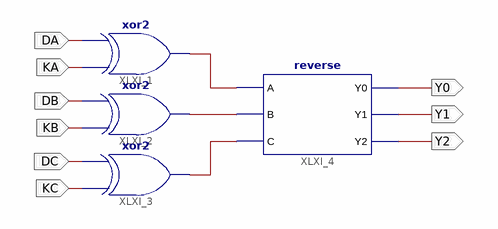
[diagram p0: schematic sheet 1]
// Xilinx ISE schematic decrypt.sch (zynq) as structural Verilog: 4 symbols, 9 ports
module decrypt (
  input  DA,
  input  KA,
  input  DB,
  input  KB,
  input  DC,
  input  KC,
  output Y0,
  output Y1,
  output Y2
);

  wire XLXN_7, XLXN_8, XLXN_9;

  xor XLXI_1 (XLXN_7, KA, DA);
  xor XLXI_2 (XLXN_8, KB, DB);
  xor XLXI_3 (XLXN_9, KC, DC);
  reverse XLXI_4 (.A(XLXN_7), .B(XLXN_8), .C(XLXN_9), .Y1(Y1), .Y2(Y2), .Y0(Y0));
endmodule
